# Altium schematic sheet EEPROM_AT24C512_SOP8.SchDoc
size A3; SheetNumber: 1; SheetTotal: 8
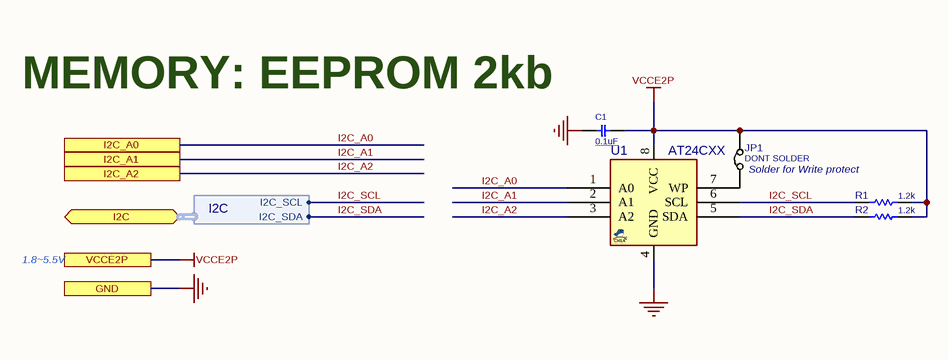
[diagram p0: EEPROM_AT24C512_SOP8.SchDoc]

## Parts
C1  0.1uF  [C0402]
JP1  DONT SOLDER  [JP_60X100]  (no BOM)
R1  1.2k  [R0402]
R2  1.2k  [R0402]
U1  AT24CXX  [SO_8]

## Ports
GND, I2C (bidir, harness I2C), I2C_A0, I2C_A1, I2C_A2, VCCE2P

## Harnesses
I2C: I2C_SCL, I2C_SDA

## Nets
GND: C1.1 U1.4(GND) ; port GND
VCCE2P: C1.2 JP1.2 R1.1 R2.1 U1.8(VCC) ; port VCCE2P
I2C_A0: U1.1(A0) ; port I2C_A0
I2C_A1: U1.2(A1) ; port I2C_A1
I2C_A2: U1.3(A2) ; port I2C_A2
I2C_SCL: R1.2 U1.6(SCL) ; port I2C.I2C_SCL
I2C_SDA: R2.2 U1.5(SDA) ; port I2C.I2C_SDA
NetJP1_1: JP1.1 U1.7(WP)

## Notes on the sheet
- MEMORY: EEPROM 2kb
- (near JP1) Solder for Write protect
- 1.8~5.5V

## Library data of the parts
C1 = CAP_SMD_MLCC: CAP, MLCC; DESC: CAP, MLCC, 1nF, 50V, C0G, 10%, 0402; MANF_P#: MANF_PART#; MANF: Murata; PARAM2: 50V; PARAM: -; PRICE: 100= 1$; ASSEMBLY: ASSEMBLY; VALUE: 0.1uF; PACKAGE: 0402
JP1 = JUMPER_SOLDER: JUMPER,  solder; MANF: MANF; MANF_P#: MANF_P#; VALUE: DONT SOLDER
R1 R2 = RES_SMD: RESISTOR, SMD; PARAM: -W; DESC: DESCRIPTION; DIST#: MOUSER; PARAM2: 1%; MANF_P#: -; MANF: -; ASSEMBLY: ASSEMBLY; PRICE: 100= 0.5$; VALUE: 1.2k; PACKAGE: 0402
U1 = EEPROM_I2C_AT24CXX_SOP8: EEPROM, I2C,; Value: AT24CXX